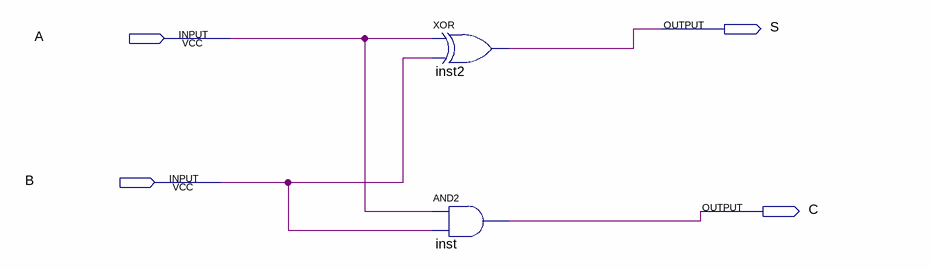
[diagram p0: schematic sheet]
// Quartus schematic lab3_1_3.bdf as structural Verilog: 2 symbols, 4 pins
module lab3_1_3 (
  input  A,
  input  B,
  output S,
  output C
);

  xor inst2 (S, A, B);
  and inst (C, A, B);
endmodule
